# Altium schematic sheet A7_FUNCTION1 -Ⅱ.SchDoc
size A3
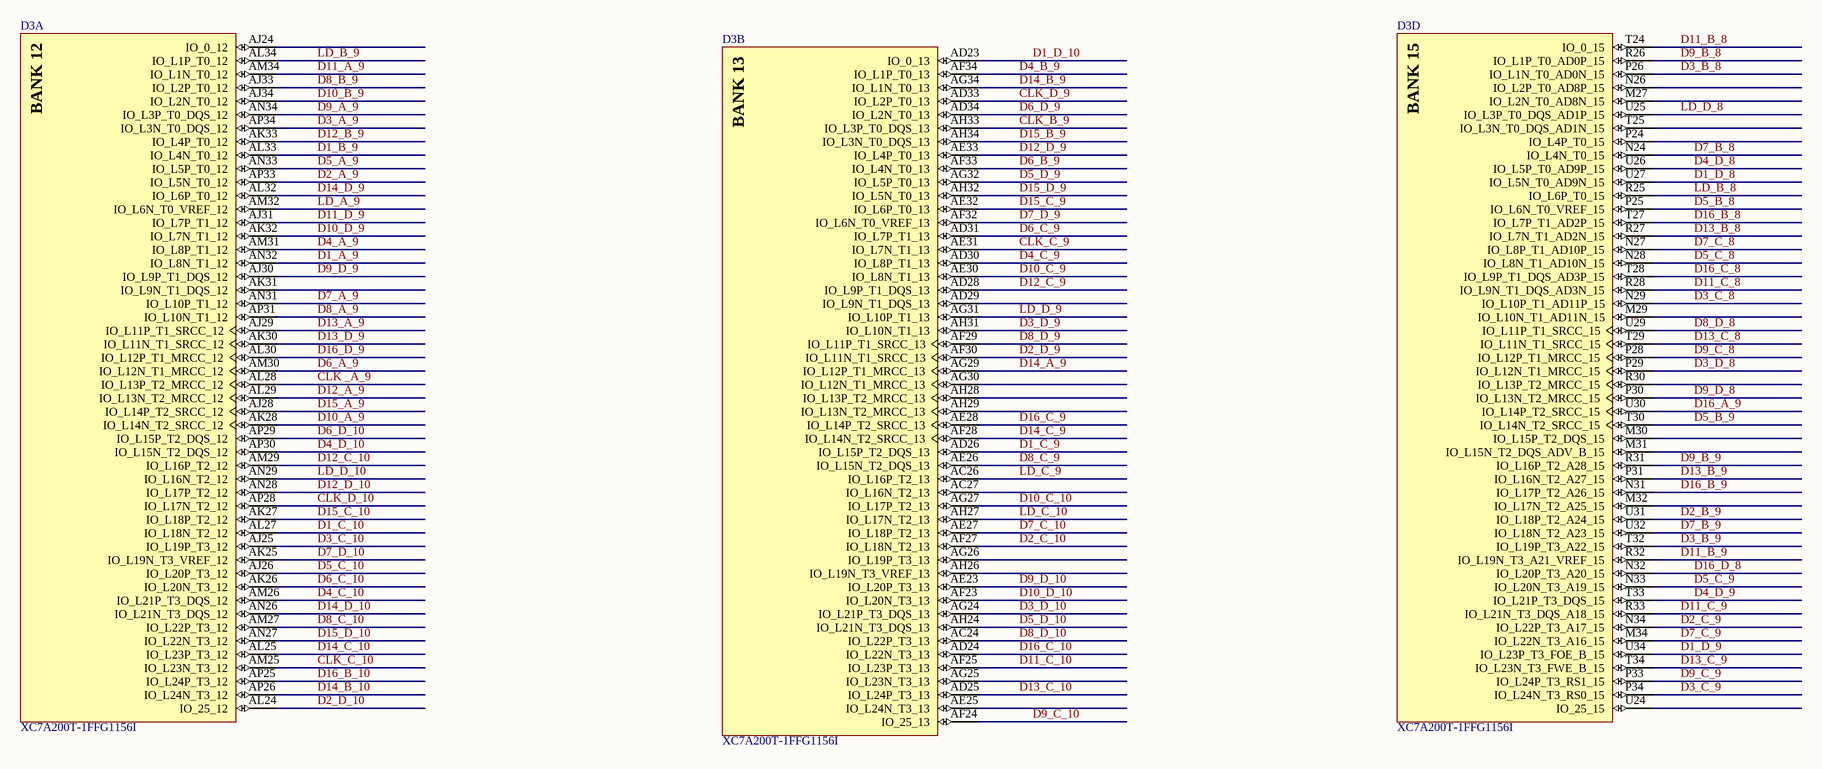
[diagram p0: A7_FUNCTION1 -Ⅱ.SchDoc]

## Parts
D3  XC7A200T-1FFG1156I  [FFG1156]  (parts A,B,D of 18)

## Nets
CLK _A_9: D3.AL28(IO_L13P_T2_MRCC_12)
CLK_B_9: D3.AH33(IO_L3P_T0_DQS_13)
CLK_C_9: D3.AE31(IO_L7N_T1_13)
CLK_C_10: D3.AM25(IO_L23N_T3_12)
CLK_D_9: D3.AD33(IO_L2P_T0_13)
CLK_D_10: D3.AP28(IO_L17N_T2_12)
D1_A_9: D3.AN32(IO_L8N_T1_12)
D1_B_9: D3.AL33(IO_L4N_T0_12)
D1_C_9: D3.AD26(IO_L15P_T2_DQS_13)
D1_C_10: D3.AL27(IO_L18N_T2_12)
D1_D_8: D3.U27(IO_L5N_T0_AD9N_15)
D1_D_9: D3.U34(IO_L23P_T3_FOE_B_15)
D1_D_10: D3.AD23(IO_0_13)
D2_A_9: D3.AP33(IO_L5N_T0_12)
D2_B_9: D3.U31(IO_L18P_T2_A24_15)
D2_C_9: D3.N34(IO_L22P_T3_A17_15)
D2_C_10: D3.AF27(IO_L18N_T2_13)
D2_D_9: D3.AF30(IO_L11N_T1_SRCC_13)
D2_D_10: D3.AL24(IO_25_12)
D3_A_9: D3.AP34(IO_L3N_T0_DQS_12)
D3_B_8: D3.P26(IO_L1N_T0_AD0N_15)
D3_B_9: D3.T32(IO_L19P_T3_A22_15)
D3_C_8: D3.N29(IO_L10P_T1_AD11P_15)
D3_C_9: D3.P34(IO_L24N_T3_RS0_15)
D3_C_10: D3.AJ25(IO_L19P_T3_12)
D3_D_8: D3.P29(IO_L12N_T1_MRCC_15)
D3_D_9: D3.AH31(IO_L10N_T1_13)
D3_D_10: D3.AG24(IO_L21P_T3_DQS_13)
D4_A_9: D3.AM31(IO_L8P_T1_12)
D4_B_9: D3.AF34(IO_L1P_T0_13)
D4_C_9: D3.AD30(IO_L8P_T1_13)
D4_C_10: D3.AM26(IO_L21P_T3_DQS_12)
D4_D_8: D3.U26(IO_L5P_T0_AD9P_15)
D4_D_9: D3.T33(IO_L21P_T3_DQS_15)
D4_D_10: D3.AP30(IO_L15N_T2_DQS_12)
D5_A_9: D3.AN33(IO_L5P_T0_12)
D5_B_8: D3.P25(IO_L6N_T0_VREF_15)
D5_B_9: D3.T30(IO_L14N_T2_SRCC_15)
D5_C_8: D3.N28(IO_L8N_T1_AD10N_15)
D5_C_9: D3.N33(IO_L20N_T3_A19_15)
D5_C_10: D3.AJ26(IO_L20P_T3_12)
D5_D_9: D3.AG32(IO_L5P_T0_13)
D5_D_10: D3.AH24(IO_L21N_T3_DQS_13)
D6_A_9: D3.AM30(IO_L12N_T1_MRCC_12)
D6_B_9: D3.AF33(IO_L4N_T0_13)
D6_C_9: D3.AD31(IO_L7P_T1_13)
D6_C_10: D3.AK26(IO_L20N_T3_12)
D6_D_9: D3.AD34(IO_L2N_T0_13)
D6_D_10: D3.AP29(IO_L15P_T2_DQS_12)
D7_A_9: D3.AN31(IO_L10P_T1_12)
D7_B_8: D3.N24(IO_L4N_T0_15)
D7_B_9: D3.U32(IO_L18N_T2_A23_15)
D7_C_8: D3.N27(IO_L8P_T1_AD10P_15)
D7_C_9: D3.M34(IO_L22N_T3_A16_15)
D7_C_10: D3.AE27(IO_L18P_T2_13)
D7_D_9: D3.AF32(IO_L6N_T0_VREF_13)
D7_D_10: D3.AK25(IO_L19N_T3_VREF_12)
D8_A_9: D3.AP31(IO_L10N_T1_12)
D8_B_9: D3.AJ33(IO_L2P_T0_12)
D8_C_9: D3.AE26(IO_L15N_T2_DQS_13)
D8_C_10: D3.AM27(IO_L22P_T3_12)
D8_D_8: D3.U29(IO_L11P_T1_SRCC_15)
D8_D_9: D3.AF29(IO_L11P_T1_SRCC_13)
D8_D_10: D3.AC24(IO_L22P_T3_13)
D9_A_9: D3.AN34(IO_L3P_T0_DQS_12)
D9_B_8: D3.R26(IO_L1P_T0_AD0P_15)
D9_B_9: D3.R31(IO_L16P_T2_A28_15)
D9_C_8: D3.P28(IO_L12P_T1_MRCC_15)
D9_C_9: D3.P33(IO_L24P_T3_RS1_15)
D9_C_10: D3.AF24(IO_25_13)
D9_D_8: D3.P30(IO_L13N_T2_MRCC_15)
D9_D_9: D3.AJ30(IO_L9P_T1_DQS_12)
D9_D_10: D3.AE23(IO_L20P_T3_13)
D10_A_9: D3.AK28(IO_L14N_T2_SRCC_12)
D10_B_9: D3.AJ34(IO_L2N_T0_12)
D10_C_9: D3.AE30(IO_L8N_T1_13)
D10_C_10: D3.AG27(IO_L17P_T2_13)
D10_D_9: D3.AK32(IO_L7N_T1_12)
D10_D_10: D3.AF23(IO_L20N_T3_13)
D11_A_9: D3.AM34(IO_L1N_T0_12)
D11_B_8: D3.T24(IO_0_15)
D11_B_9: D3.R32(IO_L19N_T3_A21_VREF_15)
D11_C_8: D3.R28(IO_L9N_T1_DQS_AD3N_15)
D11_C_9: D3.R33(IO_L21N_T3_DQS_A18_15)
D11_C_10: D3.AF25(IO_L23P_T3_13)
D11_D_9: D3.AJ31(IO_L7P_T1_12)
D12_A_9: D3.AL29(IO_L13N_T2_MRCC_12)
D12_B_9: D3.AK33(IO_L4P_T0_12)
D12_C_9: D3.AD28(IO_L9P_T1_DQS_13)
D12_C_10: D3.AM29(IO_L16P_T2_12)
D12_D_9: D3.AE33(IO_L4P_T0_13)
D12_D_10: D3.AN28(IO_L17P_T2_12)
D13_A_9: D3.AJ29(IO_L11P_T1_SRCC_12)
D13_B_8: D3.R27(IO_L7N_T1_AD2N_15)
D13_B_9: D3.P31(IO_L16N_T2_A27_15)
D13_C_8: D3.T29(IO_L11N_T1_SRCC_15)
D13_C_9: D3.T34(IO_L23N_T3_FWE_B_15)
D13_C_10: D3.AD25(IO_L24P_T3_13)
D13_D_9: D3.AK30(IO_L11N_T1_SRCC_12)
D14_A_9: D3.AG29(IO_L12P_T1_MRCC_13)
D14_B_9: D3.AG34(IO_L1N_T0_13)
D14_B_10: D3.AP26(IO_L24N_T3_12)
D14_C_9: D3.AF28(IO_L14N_T2_SRCC_13)
D14_C_10: D3.AL25(IO_L23P_T3_12)
D14_D_9: D3.AL32(IO_L6P_T0_12)
D14_D_10: D3.AN26(IO_L21N_T3_DQS_12)
D15_A_9: D3.AJ28(IO_L14P_T2_SRCC_12)
D15_B_9: D3.AH34(IO_L3N_T0_DQS_13)
D15_C_9: D3.AE32(IO_L6P_T0_13)
D15_C_10: D3.AK27(IO_L18P_T2_12)
D15_D_9: D3.AH32(IO_L5N_T0_13)
D15_D_10: D3.AN27(IO_L22N_T3_12)
D16_A_9: D3.U30(IO_L14P_T2_SRCC_15)
D16_B_8: D3.T27(IO_L7P_T1_AD2P_15)
D16_B_9: D3.N31(IO_L17P_T2_A26_15)
D16_B_10: D3.AP25(IO_L24P_T3_12)
D16_C_8: D3.T28(IO_L9P_T1_DQS_AD3P_15)
D16_C_9: D3.AE28(IO_L14P_T2_SRCC_13)
D16_C_10: D3.AD24(IO_L22N_T3_13)
D16_D_8: D3.N32(IO_L20P_T3_A20_15)
D16_D_9: D3.AL30(IO_L12P_T1_MRCC_12)
LD_A_9: D3.AM32(IO_L6N_T0_VREF_12)
LD_B_8: D3.R25(IO_L6P_T0_15)
LD_B_9: D3.AL34(IO_L1P_T0_12)
LD_C_9: D3.AC26(IO_L16P_T2_13)
LD_C_10: D3.AH27(IO_L17N_T2_13)
LD_D_8: D3.U25(IO_L3P_T0_DQS_AD1P_15)
LD_D_9: D3.AG31(IO_L10P_T1_13)
LD_D_10: D3.AN29(IO_L16N_T2_12)

Not connected (* = marked no-connect by the designer): D3 AC27(IO_L16N_T2_13) AD29(IO_L9N_T1_DQS_13) AE25(IO_L24N_T3_13) AG25(IO_L23N_T3_13) AG26(IO_L19P_T3_13) AG30(IO_L12N_T1_MRCC_13) AH26(IO_L19N_T3_VREF_13) AH28(IO_L13P_T2_MRCC_13) AH29(IO_L13N_T2_MRCC_13) AJ24(IO_0_12) AK31(IO_L9N_T1_DQS_12) M27(IO_L2N_T0_AD8N_15) M29(IO_L10N_T1_AD11N_15) M30(IO_L15P_T2_DQS_15) M31(IO_L15N_T2_DQS_ADV_B_15) M32(IO_L17N_T2_A25_15) N26(IO_L2P_T0_AD8P_15) P24(IO_L4P_T0_15) R30(IO_L13P_T2_MRCC_15) T25(IO_L3N_T0_DQS_AD1N_15) U24(IO_25_15)

## Notes on the sheet
- (in symbol XC7A200T-1FFG1156I, part A) BANK 12
- (in symbol XC7A200T-1FFG1156I, part B) BANK 13
- (in symbol XC7A200T-1FFG1156I, part D) BANK 15

## Library data of the parts
D3 = XC7A200T-1FFG1156I: Artix-7 FPGA, 500 User I/Os, 16 GTP, 1156-Ball BGA, Speed Grade 1, Industrial Grade, Pb-Free; Manufacturer: Xilinx; Block RAM Blocks (18Kb): 730; Block RAM Blocks (36Kb): 365; Block RAM Blocks (Max Kb): 13140; CLBs (Slices): 33650; Clock Mgmt Tiles (CMTs): 10; DSP48E1 Slices: 740; Logic Cells: 215360; Max User I/O: 500; Speed Grade: -1; DatasheetVersion: v1.12; PackageVersion: Rev 1.8; PackageReference: FFG1156; PackageDescription: Flip-Chip BGA, Body 35 x 35 mm, 1.0 mm Pitch; CLBs (Max Distributed RAM Kb): 2888; Generic Part Number: XC7A200T; RoHS: Pb-Free; Mounting Technology: Surface Mount; Code_JEDEC: MS-034-AAR-1; PartNumber: XC7A200T-1FFG1156I; ComponentLink1Description: Datasheet; ComponentLink1URL: http://www.xilinx.com/support/documentation/data_sheets/ds180_7Series_Overview.pdf; ComponentLink2Description: Package Specification; ComponentLink2URL: http://www.xilinx.com/support/documentation/user_guides/ug475_7Series_Pkg_Pinout.pdf; ComponentLink3Description: DC and Switching Characteristics; ComponentLink3URL: http://www.xilinx.com/support/documentation/data_sheets/ds181_Artix_7_Data_Sheet.pdf; ComponentLink4Description: Package File; ComponentLink4URL: http://www.xilinx.com/support/packagefiles/a7packages/xc7a200tfbg676pkg.txt; ComponentLink5Description: Packaging and Pinout; ComponentLink5URL: http://www.xilinx.com/support/documentation/user_guides/ug475_7Series_Pkg_Pinout.pdf